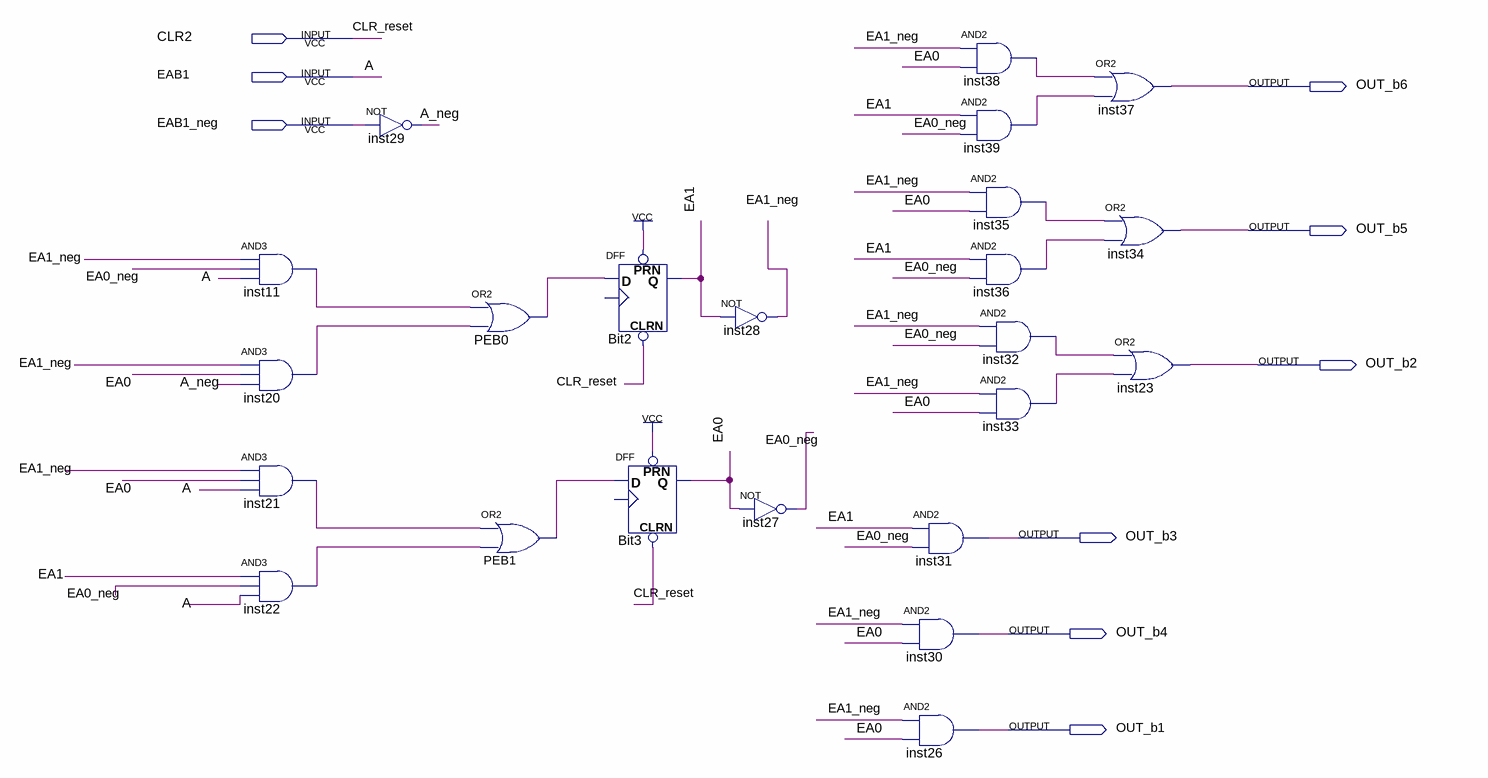
[diagram p0: schematic sheet]
// Quartus schematic fsm_bunni.bdf as structural Verilog: 23 symbols, 9 pins
module fsm_bunni (
  input  CLR2,
  input  EAB1,
  input  EAB1_neg,
  output OUT_b6,
  output OUT_b5,
  output OUT_b2,
  output OUT_b3,
  output OUT_b4,
  output OUT_b1
);

  wire A_neg, EA0, EA0_neg, EA1, EA1_neg, inst11_out, inst20_out, inst21_out, inst22_out, inst32_out,
       inst33_out, inst35_out, inst36_out, inst38_out, inst39_out, PEB0_out, PEB1_out;

  and inst11 (inst11_out, EA1_neg, EA0_neg, EAB1);
  and inst20 (inst20_out, EA1_neg, EA0, A_neg);
  and inst21 (inst21_out, EA1_neg, EA0, EAB1);
  and inst22 (inst22_out, EA1, EA0_neg, EAB1);
  not inst29 (A_neg, EAB1_neg);
  or PEB0 (PEB0_out, inst11_out, inst20_out);
  or PEB1 (PEB1_out, inst21_out, inst22_out);
  DFF Bit2 (.CLRN(CLR2), .D(PEB0_out), .PRN(1'b1), .Q(EA1));  // open: CLK
  DFF Bit3 (.CLRN(CLR2), .D(PEB1_out), .PRN(1'b1), .Q(EA0));  // open: CLK
  not inst28 (EA1_neg, EA1);
  not inst27 (EA0_neg, EA0);
  and inst31 (OUT_b3, EA1, EA0_neg);
  and inst30 (OUT_b4, EA1_neg, EA0);
  and inst26 (OUT_b1, EA1_neg, EA0);
  and inst38 (inst38_out, EA1_neg, EA0);
  and inst39 (inst39_out, EA1, EA0_neg);
  and inst35 (inst35_out, EA1_neg, EA0);
  and inst36 (inst36_out, EA1, EA0_neg);
  and inst32 (inst32_out, EA1_neg, EA0_neg);
  and inst33 (inst33_out, EA1_neg, EA0);
  or inst37 (OUT_b6, inst38_out, inst39_out);
  or inst34 (OUT_b5, inst35_out, inst36_out);
  or inst23 (OUT_b2, inst32_out, inst33_out);

  // Other names for the same wires on the sheet: A = EAB1; CLR_reset = CLR2
endmodule
